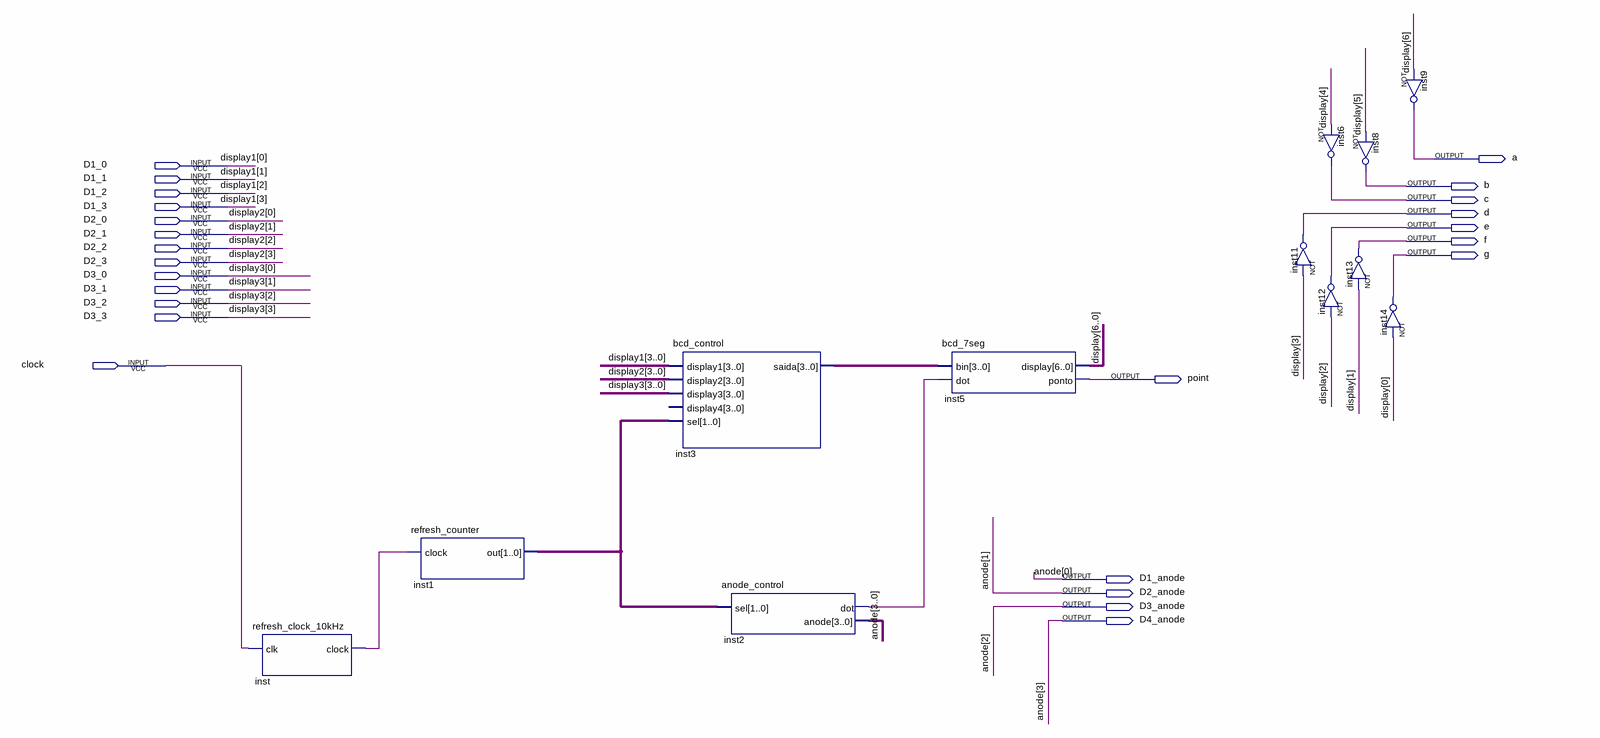
[diagram p0: schematic sheet]
// Quartus schematic segments_controller.bdf as structural Verilog: 12 symbols, 25 pins
module segments_controller (
  input  D1_0,
  input  D1_1,
  input  D1_2,
  input  D1_3,
  input  D2_0,
  input  D2_1,
  input  D2_2,
  input  D2_3,
  input  D3_0,
  input  D3_1,
  input  D3_2,
  input  D3_3,
  input  clock,
  output a,
  output b,
  output c,
  output d,
  output e,
  output f,
  output g,
  output point,
  output D1_anode,
  output D2_anode,
  output D3_anode,
  output D4_anode
);

  wire inst2_dot, inst_clock;
  wire [1:0] inst1_out;
  wire [3:0] inst3_saida;
  wire [6:0] display;

  refresh_clock_10kHz inst (.clk(clock), .clock(inst_clock));
  refresh_counter inst1 (.clock(inst_clock), .out(inst1_out));
  bcd_control inst3 (
    .display1({D1_3, D1_2, D1_1, D1_0}), .display2({D2_3, D2_2, D2_1, D2_0}),
    .display3({D3_3, D3_2, D3_1, D3_0}), .sel(inst1_out), .saida(inst3_saida));  // open: display4
  anode_control inst2 (.sel(inst1_out), .dot(inst2_dot), .anode({D4_anode, D3_anode, D2_anode, D1_anode}));
  bcd_7seg inst5 (.bin(inst3_saida), .dot(inst2_dot), .display(display), .ponto(point));
  not inst6 (c, display[4]);
  not inst11 (d, display[3]);
  not inst12 (e, display[2]);
  not inst8 (b, display[5]);
  not inst13 (f, display[1]);
  not inst14 (g, display[0]);
  not inst9 (a, display[6]);

  // Other names for the same wires on the sheet: anode[3:0] = {D4_anode, D3_anode, D2_anode, D1_anode};
  //   display1[3:0] = {D1_3, D1_2, D1_1, D1_0}; display2[3:0] = {D2_3, D2_2, D2_1, D2_0};
  //   display3[3:0] = {D3_3, D3_2, D3_1, D3_0}
endmodule
